# EAGLE design v2.0 (EAGLE 6.5.0)
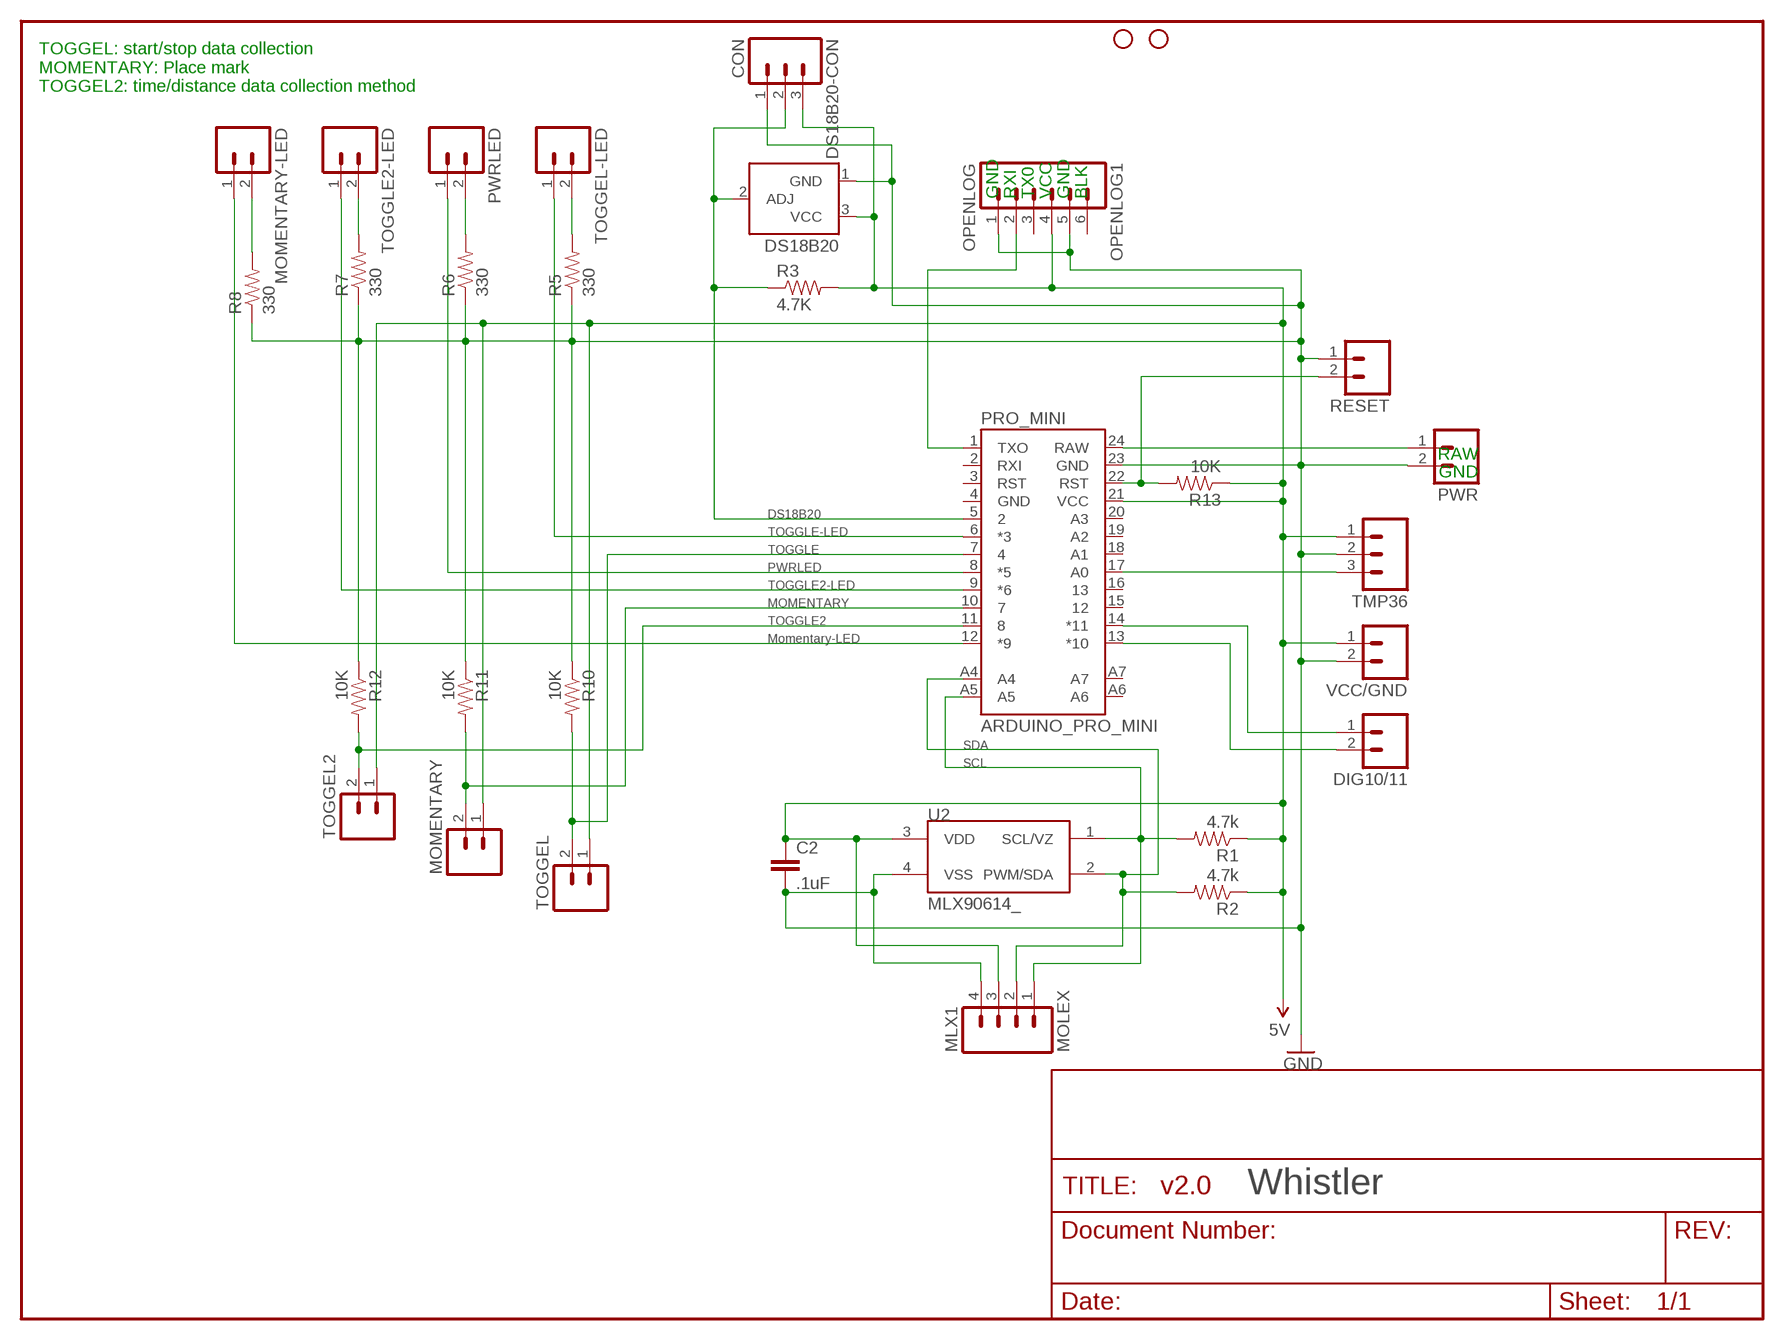
[diagram p0: schematic, sheet 1]

## Parts
C2  .1uF  0.1UF-50V-20%(PTH)KIT-EZ  [CAP-PTH-SMALL-KIT]
DIG10/11  M023.5MM_LOCK  [SCREWTERMINAL-3.5MM-2_LOCK]
DS18B20  TEMPERATURE-SENSOR  [TO-92]
DS18B20-CON  CON  M03SCREW_LOCK  [SCREWTERMINAL-3.5MM-3_LOCK.007S]
JP6  STAND-OFFTIGHT  [STAND-OFF-TIGHT]
JP7  STAND-OFFTIGHT  [STAND-OFF-TIGHT]
MLX1  MOLEX  M04SMD2  [1X04-1MM-RA]
MOMENTARY  M023.5MM_LOCK  [SCREWTERMINAL-3.5MM-2_LOCK]
MOMENTARY-LED  M023.5MM_LOCK  [SCREWTERMINAL-3.5MM-2_LOCK]
OPENLOG1  OPENLOG  M06LOCK  [1X06_LOCK]
PRO_MINI  ARDUINO_PRO_MINI  [ARDUINO_PRO_MINI]
PWR  M023.5MM_LOCK  [SCREWTERMINAL-3.5MM-2_LOCK]
PWRLED  M023.5MM_LOCK  [SCREWTERMINAL-3.5MM-2_LOCK]
R1  4.7k  RESISTORPTH-1/4W  [AXIAL-0.4]
R2  4.7k  RESISTORPTH-1/4W  [AXIAL-0.4]
R3  4.7K  RESISTORPTH-1/4W  [AXIAL-0.4]
R5  330  330OHM1/10W1%(0603)  [0603-RES]
R6  330  330OHM1/10W1%(0603)  [0603-RES]
R7  330  330OHM1/10W1%(0603)  [0603-RES]
R8  330  330OHM1/10W1%(0603)  [0603-RES]
R10  10K  10KOHM1/10W1%(0603)0603  [0603-RES]
R11  10K  10KOHM1/10W1%(0603)0603  [0603-RES]
R12  10K  10KOHM1/10W1%(0603)0603  [0603-RES]
R13  10K  10KOHM1/10W1%(0603)0603  [0603-RES]
RESET  M023.5MM_LOCK  [SCREWTERMINAL-3.5MM-2_LOCK]
TMP36  M03SCREW_LOCK  [SCREWTERMINAL-3.5MM-3_LOCK.007S]
TOGGEL  M023.5MM_LOCK  [SCREWTERMINAL-3.5MM-2_LOCK]
TOGGEL2  M023.5MM_LOCK  [SCREWTERMINAL-3.5MM-2_LOCK]
TOGGEL-LED  M023.5MM_LOCK  [SCREWTERMINAL-3.5MM-2_LOCK]
TOGGLE2-LED  M023.5MM_LOCK  [SCREWTERMINAL-3.5MM-2_LOCK]
U2  MLX90614_  [TO-39]
VCC/GND  M023.5MM_LOCK  [SCREWTERMINAL-3.5MM-2_LOCK]

## Nets
5V [5V]: C2.1 DS18B20-CON.3 DS18B20.3(VCC) MLX1.3 MOMENTARY.1 OPENLOG1.4 PRO_MINI.21(VCC) R1.P$1 R2.P$1 R3.P$2 R13.1 TMP36.1 TOGGEL2.1 TOGGEL.1 U2.3(VDD) VCC/GND.1
GND [GND]: C2.2 DS18B20-CON.1 DS18B20.1(GND) MLX1.4 OPENLOG1.1 OPENLOG1.5 PRO_MINI.23(GND) PWR.2 R5.1 R6.1 R7.1 R8.1 R10.1 R11.1 R12.1 RESET.1 TMP36.2 U2.4(VSS) VCC/GND.2
N$1: PRO_MINI.7 R10.2 TOGGEL.2
N$2: DS18B20-CON.2 DS18B20.2(ADJ) PRO_MINI.5 R3.P$1
N$3: DIG10/11.1 PRO_MINI.14(*11)
N$4: PRO_MINI.24(RAW) PWR.1
N$5: R5.2 TOGGEL-LED.2
N$6: PRO_MINI.8(*5) PWRLED.1
N$8: OPENLOG1.2 PRO_MINI.1(TXO)
N$10: MOMENTARY.2 PRO_MINI.10 R11.2
N$11: DIG10/11.2 PRO_MINI.13(*10)
N$12: PRO_MINI.6(*3) TOGGEL-LED.1
N$13: PRO_MINI.9(*6) TOGGLE2-LED.1
N$14: PWRLED.2 R6.2
N$15: R7.2 TOGGLE2-LED.2
N$16: MOMENTARY-LED.2 R8.2
N$17: MOMENTARY-LED.1 PRO_MINI.12(*9)
N$18: PRO_MINI.11 R12.2 TOGGEL2.2
N$19: PRO_MINI.22(RST) R13.2 RESET.2
N$20: PRO_MINI.17(A0) TMP36.3
N$21: MLX1.2 PRO_MINI.A4 R2.P$2 U2.2(PWM/SDA)
N$22: MLX1.1 PRO_MINI.A5 R1.P$2 U2.1(SCL/VZ)
Unconnected: OPENLOG1.3 OPENLOG1.6 PRO_MINI.2(RXI) PRO_MINI.3(RST) PRO_MINI.4(GND) PRO_MINI.15 PRO_MINI.16 PRO_MINI.18(A1) PRO_MINI.19(A2) PRO_MINI.20(A3) PRO_MINI.A6 PRO_MINI.A7

## Notes on the sheet
- TOGGEL: start/stop data collection
  MOMENTARY: Place mark
  TOGGEL2: time/distance data collection method
- GND | RXI | TX0 | VCC | GND | BLK
- RAW
- GND
- DS18B20
- TOGGLE-LED
- TOGGLE
- PWRLED
- TOGGLE2-LED
- MOMENTARY
- TOGGLE2
- Momentary-LED
- SDA
- SCL
- Whistler

## Library data of the parts
C2 = SparkFun-Capacitors:0.1UF-50V-20%(PTH): CAP-08370; PROD_ID: CAP-08370
DIG10/11 MOMENTARY MOMENTARY-LED PWR PWRLED RESET TOGGEL TOGGEL2 TOGGEL-LED TOGGLE2-LED VCC/GND = SparkFun-Connectors:M02: Standard 2-pin 0.1" header. Use with - straight break away headers ( PRT-00116) - right angle break away headers (PRT-00553) - swiss pins (PRT-00743) - machine pins (PRT-00117) - female headers (PRT-00115) Molex polarized connector foot print use with: PRT-08233 with associated crimp pins and housings. 2.54_SCREWTERM for use with PRT-10571. 3.5mm Screw Terminal footprints for PRT-08084 5mm Screw Terminal footprints for use with PRT-08433
DS18B20 = SparkFun-Sensors:TEMPERATURE-SENSOR: TO-92 temp sensor
DS18B20-CON TMP36 = SparkFun-Connectors:M03: Header 3 Standard 3-pin 0.1" header. Use with straight break away headers (SKU : PRT-00116), right angle break away headers (PRT-00553), swiss pins (PRT-00743), machine pins (PRT-00117), and female headers (PRT-00115). Molex polarized connector foot print use with SKU : PRT-08232 with associated crimp pins and housings.
JP6 JP7 = SparkFun:STAND-OFF: Stand Off This is the mechanical footprint for a #4 phillips button head screw. Use the keepout ring to avoid running the screw head into surrounding components. SKU : PRT-00447
MLX1 = SparkFun-Connectors:M04: Header 4 Standard 4-pin 0.1" header. Use with straight break away headers (SKU : PRT-00116), right angle break away headers (PRT-00553), swiss pins (PRT-00743), machine pins (PRT-00117), and female headers (PRT-00115). Molex polarized connector foot print use with SKU : PRT-08231 with associated crimp pins and housings. 1MM SMD Version SKU: PRT-10208
OPENLOG1 = SparkFun:M06: Header 6 Standard 6-pin 0.1" header. Use with straight break away headers (SKU : PRT-00116), right angle break away headers (PRT-00553), swiss pins (PRT-00743), machine pins (PRT-00117), and female headers (PRT-00115). Molex polarized connector foot print use with SKU : PRT-08094 with associated crimp pins and housings. NOTES ON THE VARIANTS LOCK and LOCK_LONGPADS... This footprint was designed to help hold the alignment of a through-hole component (i.e. 6-pin header) while soldering it into place. You may notice that each hole has been shifted either up or down by 0.005 of an inch from it's more standard position (which is a perfectly straight line). This slight alteration caused the pins (the squares in the middle) to touch the edges of the holes. Because they are alternating, it causes a "brace" to hold the component in place. 0.005 has proven to be the perfect amount of "off-center" position when using our standard breakaway headers. Although looks a little odd when you look at the bare footprint, once you have a header in there, the alteration is very hard to notice. Also, if you push a header all the way into place, it is covered up entirely on the bottom side. This idea of altering the position of holes to aid alignment will be further integrated into the Sparkfun Library for other footprints. It can help hold any component with 3 or more connection pins.
PRO_MINI = SparkFun-Boards:ARDUINO_PRO_MINI
R1-R3 = SparkFun:RESISTOR: Resistor Basic schematic elements and footprints for 0603, 1206, and PTH resistors.
R5-R8 = SparkFun-Resistors:330OHM1/10W1%(0603): RES-00818; PROD_ID: RES-00818
R10-R13 = SparkFun-Resistors:10KOHM1/10W1%(0603): RES-00824; PROD_ID: RES-00824
U2 = SparkFun:MLX90614: Melexis IR Thermometer

## Net classes
1 5V: width 0.61 mm
2 GND: width 0.61 mm

## Board
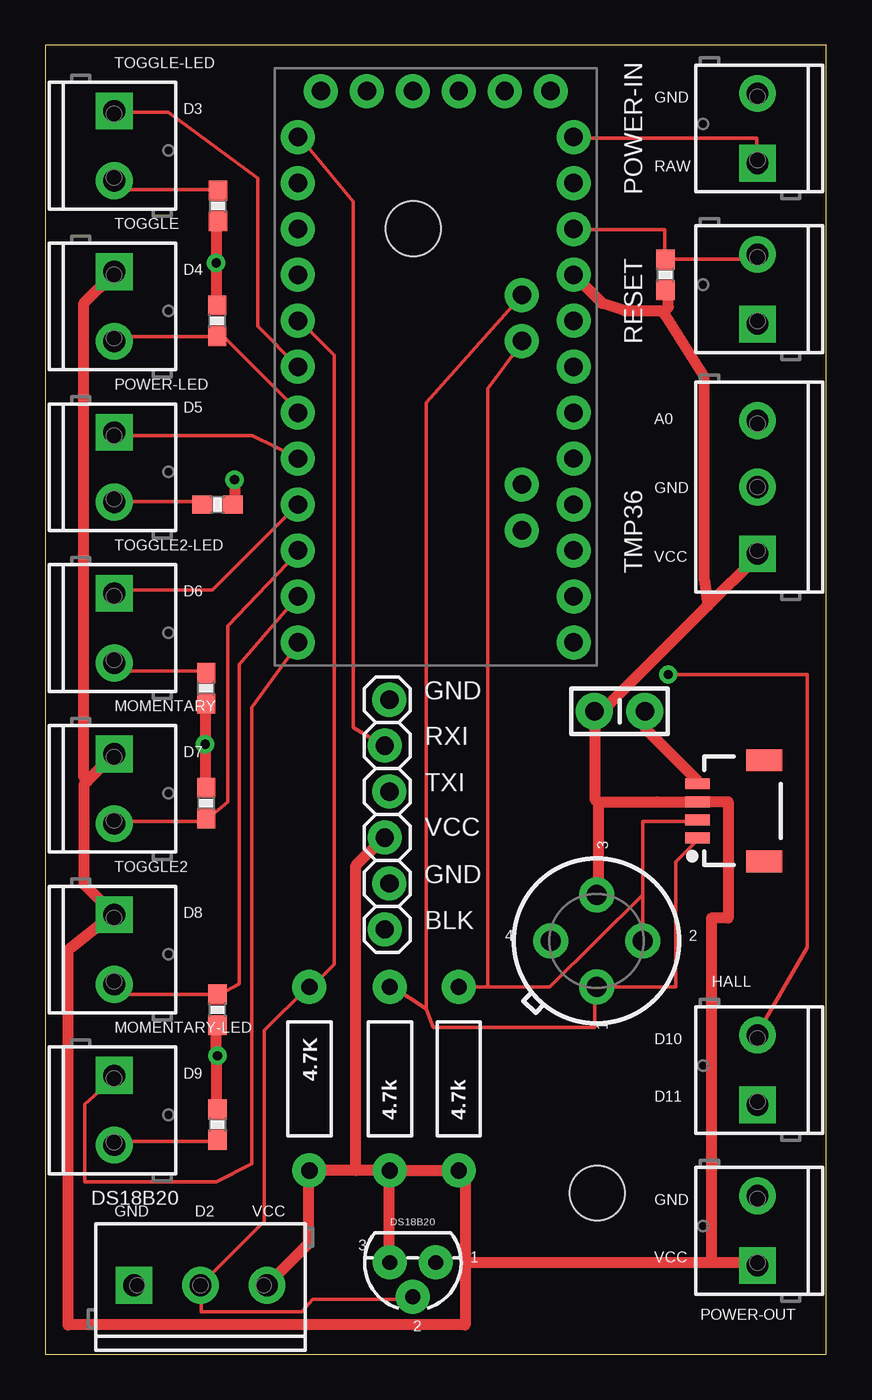
[diagram p1: board, top side]
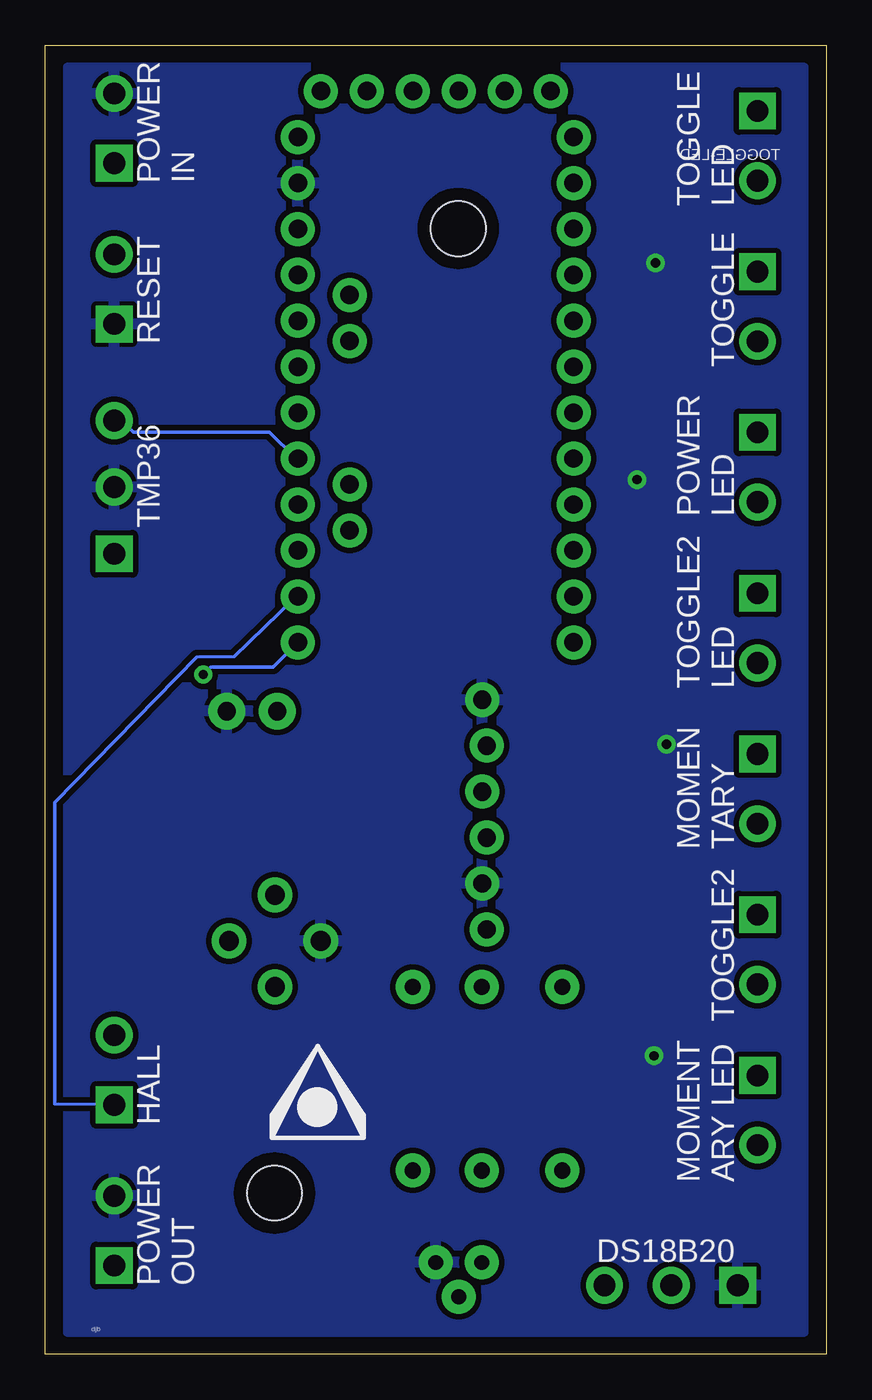
[diagram p2: board, bottom side, seen from below]

Size 43.18 x 72.39 mm. Coordinates in mm from the lower left corner, seen from the top.
Outline: 0,0 43.18,0 43.18,72.39 0,72.39 0,0
Copper layers (1*16): Top 0.035mm / dielectric 1.5mm / Bottom 0.035mm
Design rules "SparkFun *": minimum track width 8mil, minimum drill 20mil, track to track 12mil, track to pad 12mil, pad to pad 12mil, via to via 12mil, smd to smd 12mil, copper to edge 10mil, drill to drill 8mil, minimum pad ring 12mil, minimum via ring 10mil, stop-mask expansion 4mil, vias tented up to drill 25mil, thermal gap 10mil

### Footprints (pad centres in the part's own frame; a part is rotated, then mirrored left to right if it is on the bottom)
CAP-PTH-SMALL-KIT = drill 1.016 pad 2.032: 1 -1.397,0; 2 1.397,0
SCREWTERMINAL-3.5MM-2_LOCK = drill 1.2 pad 2.032 square: 1 -0.178,0 | drill 1.2 pad 2.032: 2 3.678,0
TO-92 = drill 0.813 pad 1.88: 1 -1.27,0; 2 0,1.905; 3 1.27,0
SCREWTERMINAL-3.5MM-3_LOCK.007S = drill 1.2 pad 2.032 square: 1 -0.178,0 | drill 1.2 pad 2.032: 2 3.5,0; 3 7.178,0
STAND-OFF-TIGHT = hole 3.048: 0,0
1X04-1MM-RA = smd 0.6 x 1.35: 1 -1.5,0; 2 -0.5,0; 3 0.5,0; 4 1.5,0 | smd 1.2 x 2: NC1 2.8,-3.675; NC2 -2.8,-3.675
1X06_LOCK = drill 1.016 pad 1.88: 1 0,0; 2 2.54,-0.254; 3 5.08,0; 4 7.62,-0.254; 5 10.16,0; 6 12.7,-0.254
ARDUINO_PRO_MINI = drill 1.016 pad 1.88: 1 -7.62,12.7; 2 -7.62,10.16; 3 -7.62,7.62; 4 -7.62,5.08; 5 -7.62,2.54; 6 -7.62,0; 7 -7.62,-2.54; 8 -7.62,-5.08; 9 -7.62,-7.62; 10 -7.62,-10.16; 11 -7.62,-12.7; 12 -7.62,-15.24; 13 7.62,-15.24; 14 7.62,-12.7; 15 7.62,-10.16; 16 7.62,-7.62; 17 7.62,-5.08; 18 7.62,-2.54; 19 7.62,0; 20 7.62,2.54; 21 7.62,5.08; 22 7.62,7.62; 23 7.62,10.16; 24 7.62,12.7; A4 4.763,1.429; A5 4.763,3.969; A6 4.763,-9.049; A7 4.763,-6.509; BLK -6.35,15.24; GND -3.81,15.24; GRN 6.35,15.24; RXI 1.27,15.24; TXO 3.81,15.24; VCC -1.27,15.24
AXIAL-0.4 = drill 0.9 pad 1.88: P$1 -5.08,0; P$2 5.08,0
0603-RES = smd 1.1 x 1: 1 -0.85,0; 2 0.85,0
TO-39 = drill 1.1 pad 1.93: 1 2.54,0; 2 0,2.54; 3 -2.54,0; 4 0,-2.54

### Placement (x,y rotation side)
C2  31.75,35.56 0 top
DIG10/11  39.37,13.97 90 top
DS18B20  20.32,5.08 180 top
DS18B20-CON  5.08,3.81 0 top
JP6  30.51,8.92 0 top
JP7  20.35,62.26 0 top
MLX1  36.07,30.05 90 top
MOMENTARY  3.81,33.02 270 top
MOMENTARY-LED  3.81,15.24 270 top
OPENLOG1  19.02,36.2 270 top
PRO_MINI  21.59,54.61 0 top
PWR  39.37,66.04 90 top
PWRLED  3.81,50.8 270 top
R1  19.05,15.24 90 top
R2  22.86,15.24 90 top
R3  14.61,15.24 270 top
R5  9.55,63.5 90 top
R6  9.53,46.99 180 top
R7  8.89,36.83 90 top
R8  9.53,12.7 270 top
R10  9.5,57.15 270 top
R11  8.89,30.48 270 top
R12  9.53,19.05 90 top
R13  34.29,59.69 90 top
RESET  39.37,57.15 90 top
TMP36  TMP36  [SCREWTERMINAL-3.5MM-3_LOCK.007S]  39.37,44.45 90 top
TOGGEL  3.81,59.69 270 top
TOGGEL2  3.81,24.13 270 top
TOGGEL-LED  3.81,68.58 270 top
TOGGLE2-LED  3.81,41.91 270 top
U2  30.48,22.86 270 top
VCC/GND  39.37,5.08 90 top

### Tracks (layer width: path | path; a pad name or v marks a point on that pad's centre or on a via)
5V
  Top 0.61: 34.24,57.71 32.05,57.71 30.79,58.12 PRO_MINI.21 | 30.58,30.56 30.38,30.68 30.38,35.56 C2.1 30.58,35.36 36.63,41.4 | 30.58,30.56 33.81,30.56 MLX1.3 36.27,30.56 37.74,30.56 37.74,24.13 36.83,24.13 36.83,5.08 | 30.58,30.56 30.58,25.4 U2.3 | 36.63,41.4 39.32,44.09 TMP36.1 | 36.63,41.4 36.42,42.88 36.42,54.05 34.24,57.51 34.24,57.71 | 2.34,31.7 3.76,33.12 MOMENTARY.1 | 2.34,31.7 2.13,31.5 2.13,26.01 3.76,24.38 TOGGEL2.1 3.56,24.18 1.27,22.35 1.27,1.63 23.22,1.63 23.22,5.08 | TOGGEL.1 3.76,59.74 2.13,58.12 2.13,31.9 2.34,31.7 | DS18B20.3 19,5.08 19,10.16 R1.P$1 | R1.P$1 17.17,10.16 | 17.17,10.16 R3.P$2 14.53,9.96 14.53,6.1 12.29,3.86 DS18B20-CON.3 | 17.17,10.16 17.17,27.03 18.59,28.45 OPENLOG1.4 | R1.P$1 R2.P$1 23.22,9.96 23.22,5.08 | 23.22,5.08 36.83,5.08 | 36.83,5.08 39.32,5.08 VCC/GND.1 | 34.24,57.71 34.44,57.91 34.44,58.73 34.24,58.93 R13.1
GND  (via drill 0.51)
  Top 0.61: R10.1 9.45,58.12 v9.45,60.35 9.45,62.59 R5.1 | R11.1 8.84,31.5 v8.84,33.73 8.84,35.97 R7.1 | R8.1 9.45,13.61 9.45,16.46 v9.53,16.51 9.45,16.66 9.45,18.09 R12.1 | v10.46,48.36 10.46,47.14 R6.1 | MLX1.4 36.07,31.7 33.22,34.54 33.22,35.56 C2.2
  pour Bottom (isolate 0.305): 1.27,71.12 41.91,71.12 41.91,1.27 1.27,1.27
N$1
  Top 0.203: TOGGEL.2 3.96,56.08 3.96,56.29 9.45,56.29 R10.2 9.65,56.49 13.92,52.22 PRO_MINI.7
N$2
  Top 0.203: DS18B20.2 20.22,3.05 14.78,3.05 14.17,2.36 8.64,2.36 8.64,3.66 DS18B20-CON.2 8.64,3.86 12.12,7.34 12.12,17.91 14.53,20.32 R3.P$1 14.73,20.32 15.98,21.56 15.98,55.25 14.12,57.1 PRO_MINI.5
N$3
  Bottom 0.203: PRO_MINI.14 29.36,41.86 32.74,38.58 34.8,38.56 42.65,30.51 42.65,13.84 39.52,13.82 DIG10/11.1
N$4
  Top 0.203: PRO_MINI.24 29.36,67.26 39.32,67.26 39.32,66.04 PWR.1
N$5
  Top 0.203: R5.2 9.45,64.41 3.96,64.41 3.96,64.82 TOGGEL-LED.2
N$6
  Top 0.203: PRO_MINI.8 13.92,49.58 11.45,50.8 3.96,50.8 PWRLED.1
N$8
  Top 0.203: OPENLOG1.2 18.59,33.73 17.02,34.67 17.02,63.73 14.12,67.26 PRO_MINI.1
N$10
  Top 0.203: MOMENTARY.2 3.96,29.46 8.84,29.46 R11.2 9.04,29.67 10.08,30.53 10.08,40.28 13.92,44.3 PRO_MINI.10
N$11  (via drill 0.51)
  Top 0.203: v34.44,37.59 42.11,37.59 42.11,22.5 39.32,17.68 DIG10/11.2
  Bottom 0.203: PRO_MINI.13 30.58,38 34.04,38 v34.44,37.59
N$12
  Top 0.203: PRO_MINI.6 11.73,56.84 11.73,65.02 6.81,68.68 3.96,68.68 TOGGEL-LED.1
N$13
  Top 0.203: PRO_MINI.9 9.25,42.27 3.96,42.27 TOGGLE2-LED.1
N$14
  Top 0.203: R6.2 8.64,47.14 3.96,47.14 PWRLED.2
N$15
  Top 0.203: R7.2 8.84,37.8 3.96,37.8 3.96,38.2 TOGGLE2-LED.2
N$16
  Top 0.203: R8.2 9.45,11.79 3.96,11.79 3.96,11.58 MOMENTARY-LED.2
N$17
  Top 0.203: PRO_MINI.12 13.92,39.22 11.41,35.76 11.41,10.54 9.45,9.53 2.18,9.53 2.18,13.82 3.76,15.24 MOMENTARY-LED.1
N$18
  Top 0.203: TOGGEL2.2 3.96,20.32 3.96,19.91 9.45,19.91 R12.2 9.65,19.91 10.72,20.47 10.72,38.15 PRO_MINI.11
N$19
  Top 0.203: PRO_MINI.22 29.36,62.18 34.24,62.18 34.24,60.55 R13.2 34.44,60.55 39.32,60.55 39.32,60.76 RESET.2
N$20
  Bottom 0.203: PRO_MINI.17 29.36,49.58 30.79,51 38.3,51 38.91,51.61 39.32,51.61 TMP36.3
N$21
  Top 0.203: U2.2 33.02,25.4 | 33.02,25.4 33.02,29.46 36.07,29.46 MLX1.2 | 24.46,20.32 R2.P$2 | 24.46,20.32 27.89,20.32 33.02,25.4 | 24.46,20.32 24.46,53.39 26.31,55.88 PRO_MINI.A4
N$22
  Top 0.203: 21.06,19.1 21.44,18.09 30.38,18.09 30.38,20.32 U2.1 34.85,20.32 34.85,27.23 36.07,28.45 MLX1.1 | 21.06,19.1 19.2,20.32 R1.P$2 | 21.06,19.1 21.06,52.63 26.31,58.52 PRO_MINI.A5

### Text on the board
tPlace: TOGGLE-LED | D3 | GND | RAW | POWER-IN | TOGGLE | D4 | RESET | POWER-LED | D5 | A0 | GND | TOGGLE2-LED | VCC | TMP36 | D6 | MOMENTARY | GND | RXI | D7 | TXI | VCC | 3 | TOGGLE2 | GND | D8 | BLK | 4 | 2 | HALL | MOMENTARY-LED | 1 | D10 | D9 | D11 | DS18B20 | GND | D2 | VCC | GND | 3 | 1 | VCC | POWER-OUT | 2
bPlace: TOGGLE-LED | POWER / IN | TOGGLE / LED | RESET | TOGGLE | POWER / LED | TMP36 | TOGGLE2 / LED | MOMEN / TARY | TOGGLE2 | HALL | MOMENT / ARY LED | DS18B20 | POWER / OUT | djb